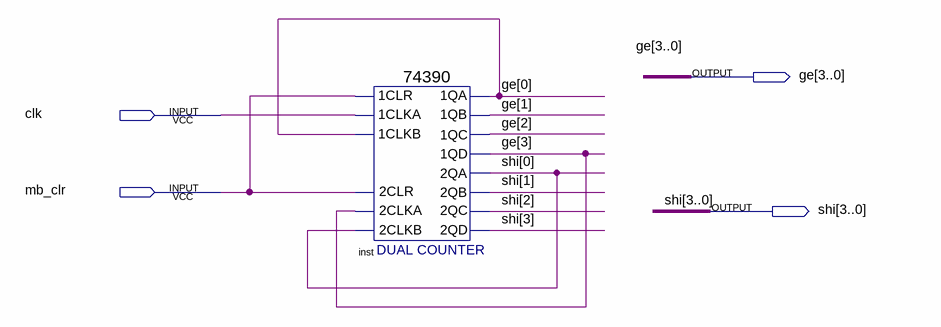
[diagram p0: schematic sheet]
// Quartus schematic counter100.bdf as structural Verilog: 1 symbols, 4 pins
module counter100 (
  input  clk,
  input  mb_clr,
  output [3:0] ge,
  output [3:0] shi
);

  \74390  inst (
    .\2CLKA (ge[3]), .\2CLR (mb_clr), .\2CLKB (shi[0]), .\1CLR (mb_clr), .\1CLKA (clk), .\1CLKB (ge[0]),
    .\1QA (ge[0]), .\1QB (ge[1]), .\1QC (ge[2]), .\1QD (ge[3]), .\2QA (shi[0]), .\2QB (shi[1]),
    .\2QC (shi[2]), .\2QD (shi[3]));
endmodule
